# EAGLE design led-mosfet (EAGLE 9.2.0)
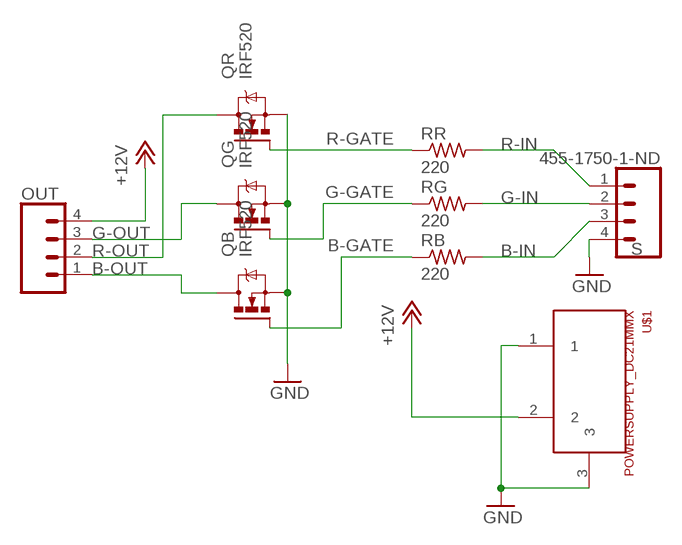
[diagram p0: schematic, sheet 1]

## Parts
OUT  CONN_04  [1X04]
QB  IRF520  [TO220BV]
QG  IRF520  [TO220BV]
QR  IRF520  [TO220BV]
RB  220  R-US_R0805  [R0805]
RG  220  R-US_R0805  [R0805]
RR  220  R-US_R0805  [R0805]
S  455-1750-1-ND  CONN_04  [1X04]
U$1  POWERSUPPLY_DC21MMX  [POWERSUPPLY_DC-21MM]

## Nets
+12V: OUT.4 U$1.2
B-GATE: QB.G RB.1
B-IN: RB.2 S.3
B-OUT: OUT.1 QB.D
G-GATE: QG.G RG.1
G-IN: RG.2 S.2
G-OUT: OUT.3 QG.D
GND: QB.S QG.S QR.S S.4 U$1.1 U$1.3
R-GATE: QR.G RR.1
R-IN: RR.2 S.1
R-OUT: OUT.2 QR.D

## Library data of the parts
OUT S = SparkFun-Connectors:CONN_04: Multi connection point. Often used as Generic Header-pin footprint for 0.1 inch spaced/style header connections On any of the 0.1 inch spaced packages, you can populate with these: Break Away Headers - Straight <https://www.sparkfun.com/products/116> (PRT-00116) Break Away Male Headers - Right Angle <https://www.sparkfun.com/products/553> (PRT-00553) Female Headers <https://www.sparkfun.com/products/115> (PRT-00115) Break Away Headers - Machine Pin <https://www.sparkfun.com/products/117> (PRT-00117) Break Away Female Headers - Swiss Machine Pin <https://www.sparkfun.com/products/743> (PRT-00743) For SCREWTERMINALS and SPRING TERMINALS visit here: Screw Terimnals on SparkFun.com <https://www.sparkfun.com/search/results?term=Screw+Terminals> (5mm/3.5mm/2.54mm spacing) This device is also useful as a general connection point to wire up your design to another part of your project. Our various solder wires solder well into these plated through hole pads. Hook-Up Wire - Assortment (Stranded, 22 AWG) <https://www.sparkfun.com/products/11375> (PRT-11375) Hook-Up Wire - Assortment (Solid Core, 22 AWG) <https://www.sparkfun.com/products/11367> (PRT-11367) View the entire wire category on our website here <https://www.sparkfun.com/categories/141> Special notes: Molex polarized connector foot print use with SKU : PRT-08231 with associated crimp pins and housings. 1MM SMD Version SKU: PRT-10208; PROD_ID: CONN-09696
QB QG QR = transistor-power:IRF520: HEXFET Power MOSFET
RB RG RR = rcl:R-US_: RESISTOR, American symbol; SPICEPREFIX: R
U$1 = SmartPrj:POWERSUPPLY_DC21MM

## Board
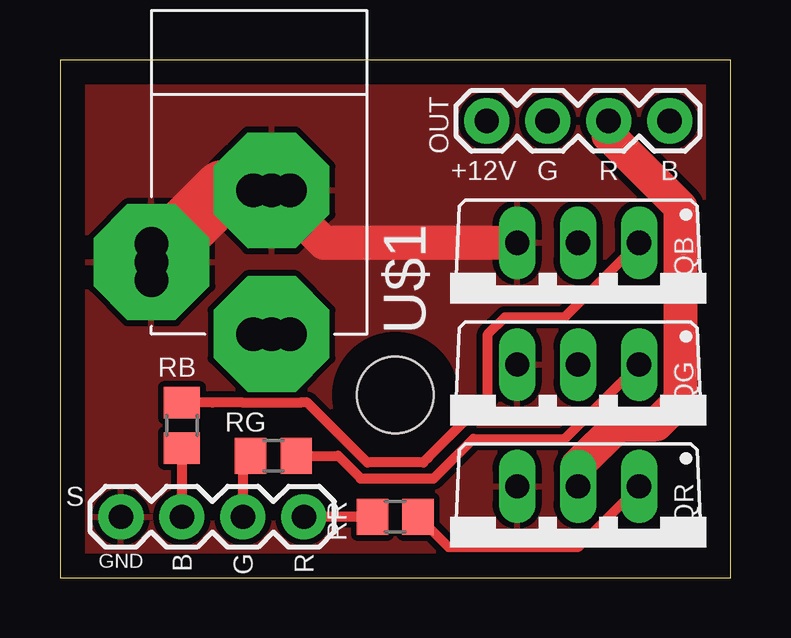
[diagram p1: board, top side]
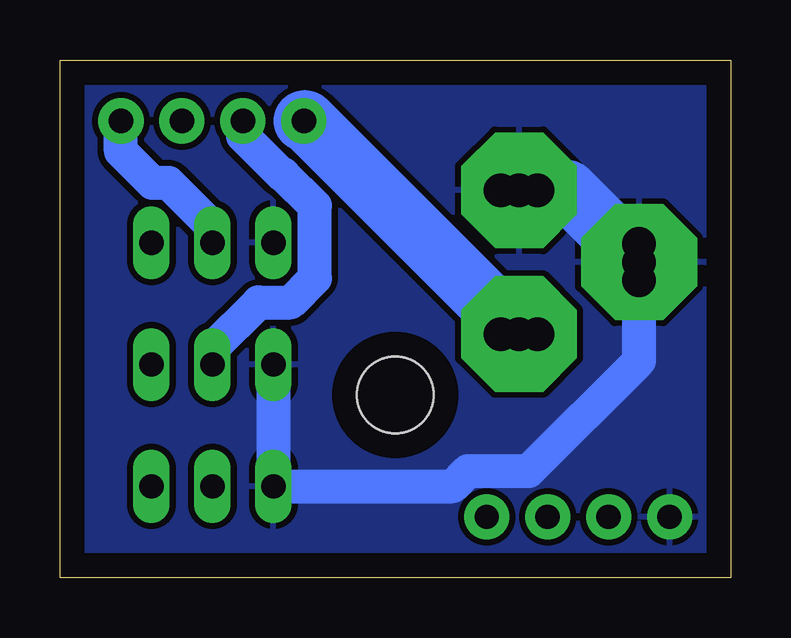
[diagram p2: board, bottom side, seen from below]

Size 27.94 x 21.59 mm. Coordinates in mm from the lower left corner, seen from the top.
Outline: 0,0 27.94,0 27.94,21.59 0,21.59 0,0
Copper layers (1*16): Top 0.035mm / dielectric 1.5mm / Bottom 0.035mm
Design rules "default *": minimum track width 6mil, minimum drill 0.35mm, track to track 10mil, track to pad 10mil, pad to pad 10mil, via to via 10mil, smd to smd 10mil, copper to edge 40mil, drill to drill 6mil, minimum pad ring 10mil, minimum via ring 8mil, stop-mask expansion 4mil, vias tented up to drill 0mil, thermal gap 10mil
Holes 3.2 mm at 13.97,7.62

### Footprints (pad centres in the part's own frame; a part is rotated, then mirrored left to right if it is on the bottom)
1X04 = drill 1.016 pad 1.88: 1 0,0; 2 2.54,0; 3 5.08,0; 4 7.62,0
TO220BV = drill 1.016 long: D 0,-2.54; G -2.54,-2.54; S 2.54,-2.54
R0805 = smd 1.3 x 1.5: 1 -0.95,0; 2 0.95,0
POWERSUPPLY_DC-21MM = drill 1.4 pad 4.826 octagon: 1 -5.08,-3.353; 2 -0.076,-6.35; 3 -0.076,-0.356 | drill 1.4: 4 -5.08,-4.115; 5 -5.08,-2.591; 6 -0.838,-0.356; 7 0.686,-0.356; 8 -0.838,-6.35; 9 0.686,-6.35

### Placement (x,y rotation side)
OUT  25.4,19.05 180 top
QB  21.59,11.43 180 top
QG  21.59,6.35 180 top
QR  21.59,1.27 180 top
RB  5.08,6.35 270 top
RG  8.89,5.08 180 top
RR  13.97,2.54 180 top
S  10.16,2.54 180 top
U$1  8.89,16.51 0 top

### Tracks (layer width: path | path; a pad name or v marks a point on that pad's centre or on a via)
+12V
  Bottom 2.54: U$1.2 17.7,19.05 OUT.4
B-GATE
  Top 0.406: RB.1 6.35,7.3 7.62,7.3 7.62,7.29 10,7.29 10.01,7.3 10.3,7.3 12.8,4.8 15.14,4.8 15.33,4.99 17.83,7.49 17.83,10.16 18.54,10.87 21.03,10.87 QB.G
B-IN
  Top 0.406: RB.2 S.3
B-OUT
  Bottom 1.422: OUT.1 25.4,17.78 24.08,16.46 23.41,16.46 21.59,14.63 QB.D
G-GATE
  Top 0.406: QG.G 21.03,5.79 17.22,5.79 15.57,4.14 12.53,4.14 11.59,5.08 RG.1
G-IN
  Top 0.406: RG.2 7.62,4.76 S.2
G-OUT
  Bottom 1.422: QG.D 21.59,9.55 19.66,11.48 18.34,11.48 17.32,12.49 17.32,15.51 18.63,16.81 18.71,16.81 20.32,18.43 OUT.3
GND
  Top 1.422: U$1.3 11,13.97 QB.S
  Top 2.54: U$1.1 6.81,16.15 U$1.3
  Bottom 1.422: QG.S QR.S 11.58,3.81 10.95,4.45 8.41,4.45 3.81,9.04 U$1.1
  Bottom 2.54: U$1.1 6.81,16.15 U$1.3
  pour Top: 0,20.32 1.27,21.59 26.67,21.59 27.94,20.32 27.94,1.27 26.67,0 1.27,0 0,1.27
  pour Bottom: 0,20.32 1.27,21.59 26.67,21.59 27.94,20.32 27.94,1.27 26.67,0 1.27,0 0,1.27
R-GATE
  Top 0.406: RR.1 16.19,1.27 21.59,1.27 QR.G
R-IN
  Top 0.406: RR.2 S.1
R-OUT
  Top 1.422: QR.D 21.59,4.7 23.29,6.4 24.84,6.4 25.86,7.41 25.86,15.45 22.86,18.45 OUT.2

### Text on the board
tPlace: GND
tNames: +12V | G | R | B | B | G | R